# Altium schematic sheet 04_Schematic.SchDoc
size A3; SheetNumber: 4; SheetTotal: 4
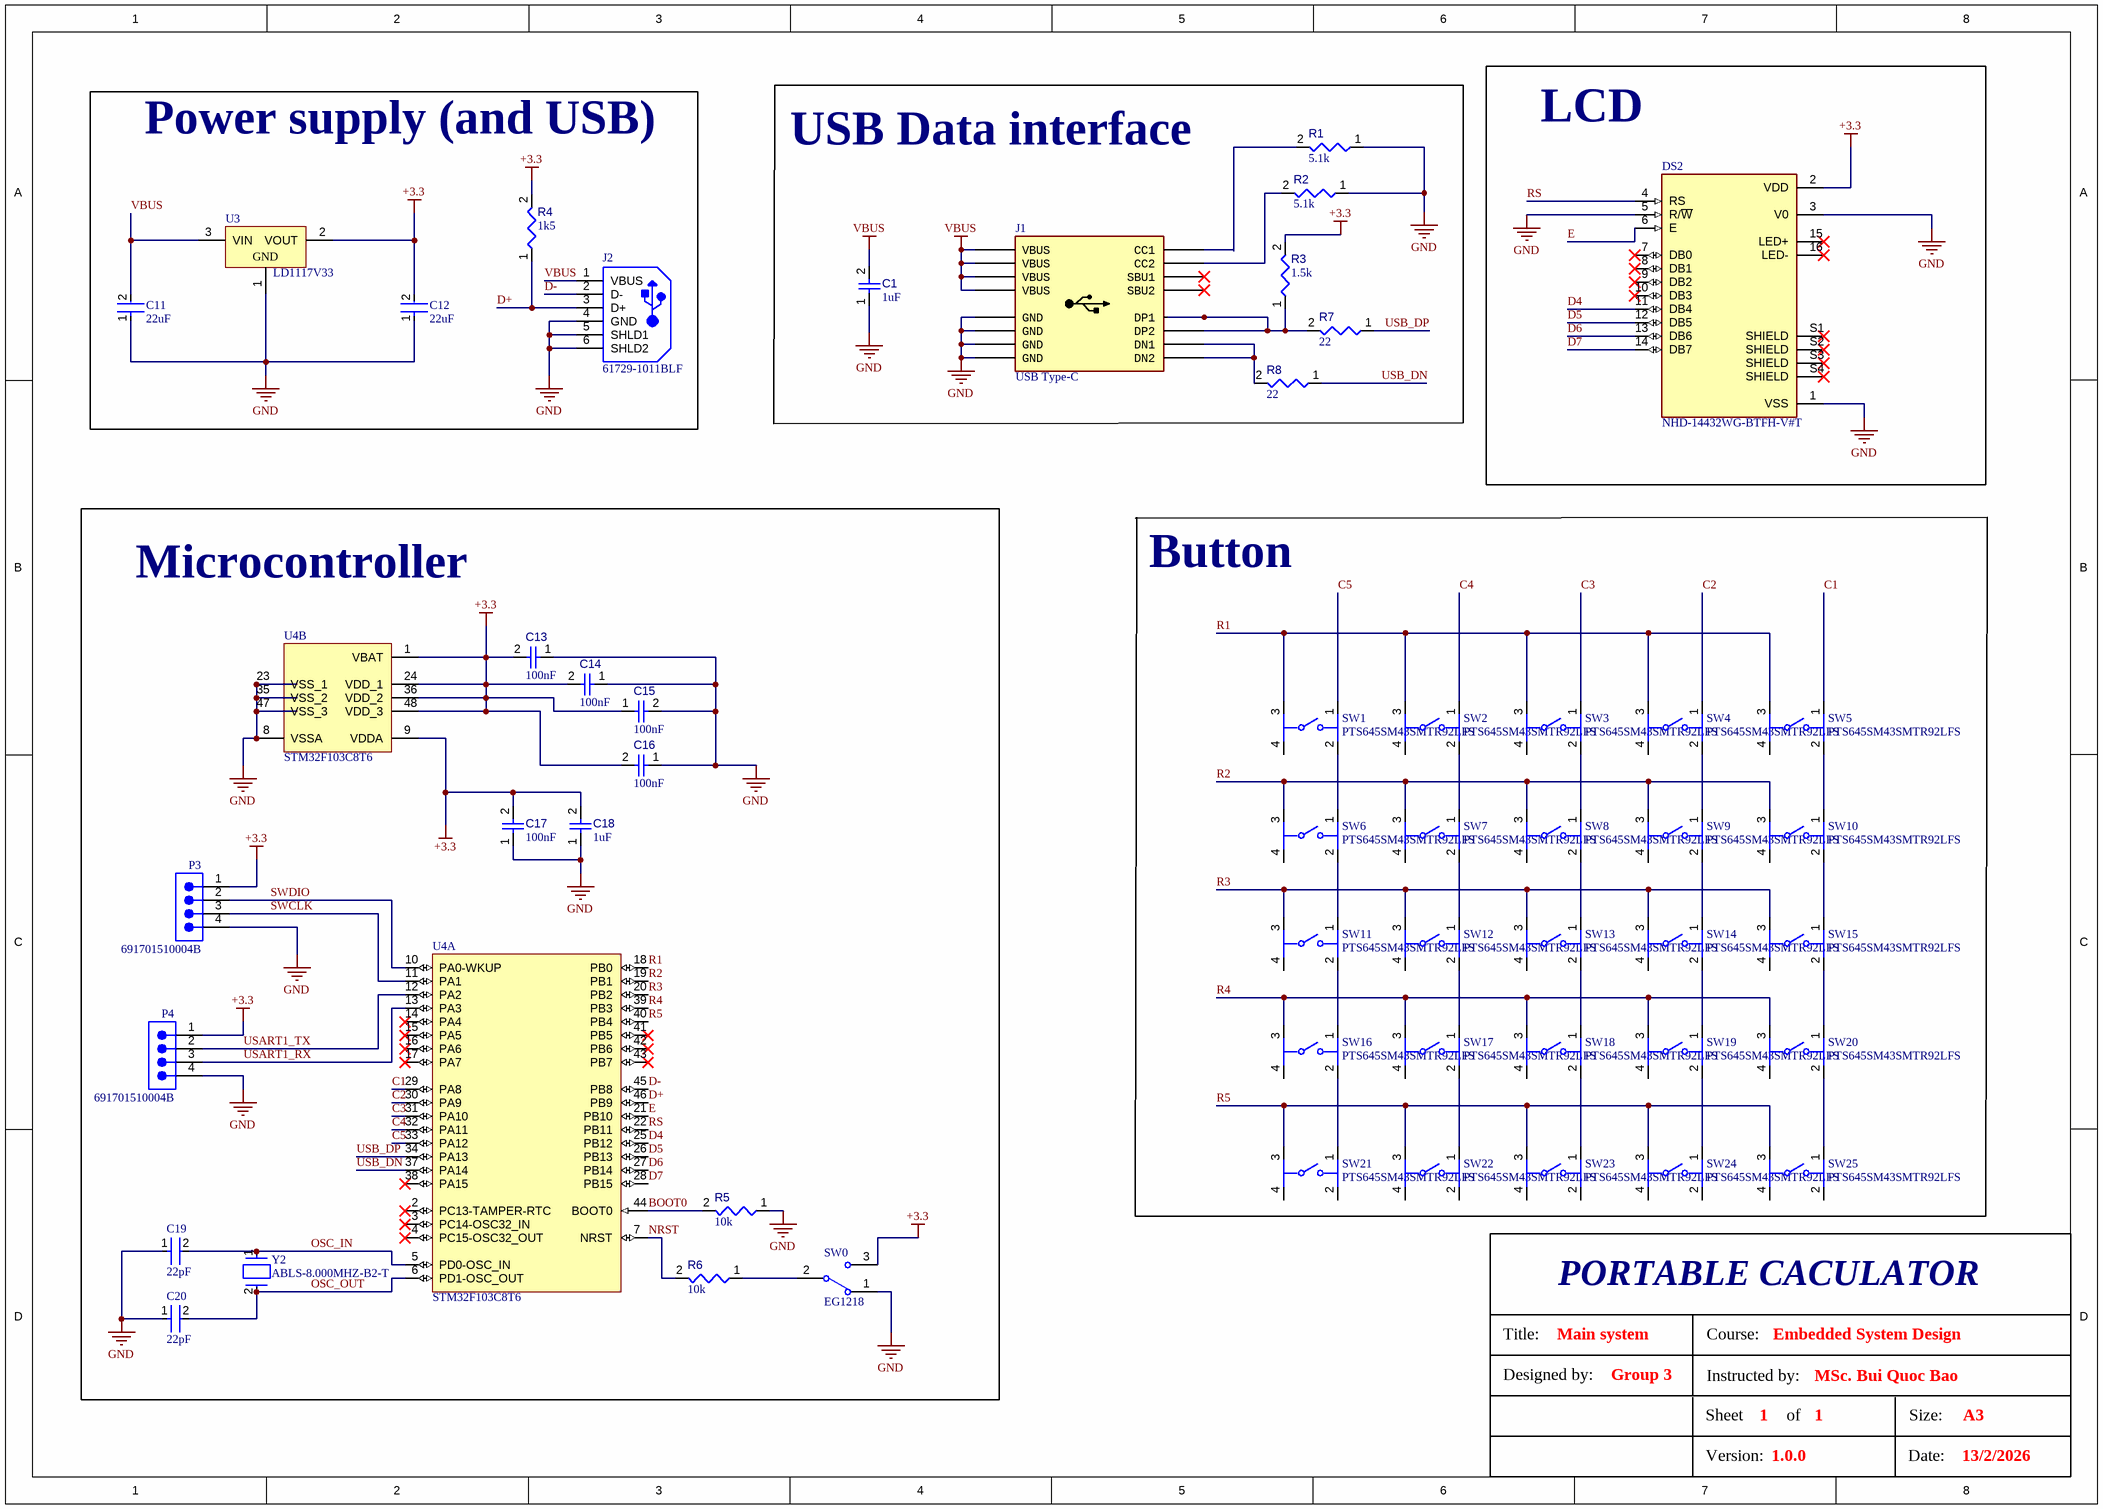
[diagram p0: 04_Schematic.SchDoc]

## Parts
C1  value 1uF  [CAPC1005X56X25LL10T15]  (hidden comment: Capacitor 0.1 uF +/- 5% 16 V 0402)
C11  22uF  [FP-RCE0K1-MFG]
C12  22uF  [FP-RCE0K1-MFG]
C13  value 100nF  [CAPC1005X56X25LL10T15]  (hidden comment: Capacitor 0.1 uF +/- 5% 16 V 0402)
C14  value 100nF  [CAPC1005X56X25LL10T15]  (hidden comment: Capacitor 0.1 uF +/- 5% 16 V 0402)
C15  value 100nF  [CAPC1005X56X25LL10T15]  (hidden comment: Capacitor 0.1 uF +/- 5% 16 V 0402)
C16  value 100nF  [CAPC1005X56X25LL10T15]  (hidden comment: Capacitor 0.1 uF +/- 5% 16 V 0402)
C17  value 100nF  [CAPC1005X56X25LL10T15]  (hidden comment: Capacitor 0.1 uF +/- 5% 16 V 0402)
C18  value 1uF  [CAPC1005X56X25LL10T15]  (hidden comment: Capacitor 0.1 uF +/- 5% 16 V 0402)
C19  22pF  [FP-RCE0K1-MFG]
C20  22pF  [FP-RCE0K1-MFG]
DS2  NHD-14432WG-BTFH-V#T  [LCD_NHD-14432WG-BTFH-V#T]
J1  USB Type-C  [TYPE-C-16POS]
J2  61729-1011BLF  [FCI-61729-1011BLF_V]
P3  691701510004B  [691701510004B]
P4  691701510004B  [691701510004B]
R1  value 5.1k  [RESC0402(1005)_L]  (hidden comment: Resistor 1K +/-5 % 0402 63 mW)
R2  value 5.1k  [RESC0402(1005)_L]  (hidden comment: Resistor 1K +/-5 % 0402 63 mW)
R3  value 1.5k  [RESC0402(1005)_L]  (hidden comment: Resistor 1K +/-5 % 0402 63 mW)
R4  value 1k5  [RESC0402(1005)_L]  (hidden comment: Resistor 1K +/-5 % 0402 63 mW)
R5  value 10k  [RESC0402(1005)_L]  (hidden comment: Resistor 1K +/-5 % 0402 63 mW)
R6  value 10k  [RESC0402(1005)_L]  (hidden comment: Resistor 1K +/-5 % 0402 63 mW)
R7  value 22  [RESC0402(1005)_L]  (hidden comment: Resistor 1K +/-5 % 0402 63 mW)
R8  value 22  [RESC0402(1005)_L]  (hidden comment: Resistor 1K +/-5 % 0402 63 mW)
SW0  EG1218  [ESWI-EG1218_V]
SW1  PTS645SM43SMTR92LFS  [FP-PTS645SM43SMTR92LFS-MFG]
SW2  PTS645SM43SMTR92LFS  [FP-PTS645SM43SMTR92LFS-MFG]
SW3  PTS645SM43SMTR92LFS  [FP-PTS645SM43SMTR92LFS-MFG]
SW4  PTS645SM43SMTR92LFS  [FP-PTS645SM43SMTR92LFS-MFG]
SW5  PTS645SM43SMTR92LFS  [FP-PTS645SM43SMTR92LFS-MFG]
SW6  PTS645SM43SMTR92LFS  [FP-PTS645SM43SMTR92LFS-MFG]
SW7  PTS645SM43SMTR92LFS  [FP-PTS645SM43SMTR92LFS-MFG]
SW8  PTS645SM43SMTR92LFS  [FP-PTS645SM43SMTR92LFS-MFG]
SW9  PTS645SM43SMTR92LFS  [FP-PTS645SM43SMTR92LFS-MFG]
SW10  PTS645SM43SMTR92LFS  [FP-PTS645SM43SMTR92LFS-MFG]
SW11  PTS645SM43SMTR92LFS  [FP-PTS645SM43SMTR92LFS-MFG]
SW12  PTS645SM43SMTR92LFS  [FP-PTS645SM43SMTR92LFS-MFG]
SW13  PTS645SM43SMTR92LFS  [FP-PTS645SM43SMTR92LFS-MFG]
SW14  PTS645SM43SMTR92LFS  [FP-PTS645SM43SMTR92LFS-MFG]
SW15  PTS645SM43SMTR92LFS  [FP-PTS645SM43SMTR92LFS-MFG]
SW16  PTS645SM43SMTR92LFS  [FP-PTS645SM43SMTR92LFS-MFG]
SW17  PTS645SM43SMTR92LFS  [FP-PTS645SM43SMTR92LFS-MFG]
SW18  PTS645SM43SMTR92LFS  [FP-PTS645SM43SMTR92LFS-MFG]
SW19  PTS645SM43SMTR92LFS  [FP-PTS645SM43SMTR92LFS-MFG]
SW20  PTS645SM43SMTR92LFS  [FP-PTS645SM43SMTR92LFS-MFG]
SW21  PTS645SM43SMTR92LFS  [FP-PTS645SM43SMTR92LFS-MFG]
SW22  PTS645SM43SMTR92LFS  [FP-PTS645SM43SMTR92LFS-MFG]
SW23  PTS645SM43SMTR92LFS  [FP-PTS645SM43SMTR92LFS-MFG]
SW24  PTS645SM43SMTR92LFS  [FP-PTS645SM43SMTR92LFS-MFG]
SW25  PTS645SM43SMTR92LFS  [FP-PTS645SM43SMTR92LFS-MFG]
U3  LD1117V33  [STM-TO220-3]
U4  STM32F103C8T6  [STM-LQFP48_M]  (parts A,B of 2)
Y2  ABLS-8.000MHZ-B2-T  [FP-ABLS-MFG]

## Blocks framed on the sheet
LCD: DS2
Power supply (and USB): C11 C12 J2 R4 U3
USB Data interface: C1 J1 R1-R3 R7 R8
Microcontroller: C13-C20 P3 P4 R5 R6 SW0 U4 Y2
Button: SW1-SW25

## Nets
+3.3: C12.2 C13.2 C14.2 C15.1 C16.2 C17.2 C18.2 DS2.2(VDD) P3.1 P4.1 R3.2 R4.2 SW0.3 U3.2(VOUT) U4.1(VBAT) U4.9(VDDA) U4.24(VDD_1) U4.36(VDD_2) U4.48(VDD_3)
GND: C1.1 C11.1 C12.1 C13.1 C14.1 C15.2 C16.1 C17.1 C18.1 C19.1 C20.1 DS2.1(VSS) DS2.3(V0) DS2.5(R/~{W}) J1.A1_B12(GND) J1.A12_B1(GND) J2.4(GND) J2.5(SHLD1) J2.6(SHLD2) P3.4 P4.4 R1.1 R2.1 R5.1 SW0.1 U3.1(GND) U4.8(VSSA) U4.23(VSS_1) U4.35(VSS_2) U4.47(VSS_3)
VBUS: C1.2 C11.2 J1.A4_B9(VBUS) J1.A9_B4(VBUS) J2.1(VBUS) U3.3(VIN)
BOOT0: R5.2 U4.44(BOOT0)
C1: SW5.1 U4.29(PA8)
C2: SW4.1 U4.30(PA9)
C3: SW3.1 U4.31(PA10)
C4: SW2.1 U4.32(PA11)
C5: SW1.1 U4.33(PA12)
D4: DS2.11(DB4) U4.25(PB12)
D5: DS2.12(DB5) U4.26(PB13)
D6: DS2.13(DB6) U4.27(PB14)
D7: DS2.14(DB7) U4.28(PB15)
D+: J2.3(D+) R4.1 U4.46(PB9)
D-: J2.2(D-) U4.45(PB8)
E: DS2.6(E) U4.21(PB10)
NRST: R6.2 U4.7(NRST)
OSC_IN: C19.2 U4.5(PD0-OSC_IN) Y2.1
OSC_OUT: C20.2 U4.6(PD1-OSC_OUT) Y2.2
R1: SW1.3 SW2.3 SW3.3 SW4.3 SW5.3 U4.18(PB0)
R2: SW6.3 SW7.3 SW8.3 SW9.3 SW10.3 U4.19(PB1)
R3: SW11.3 SW12.3 SW13.3 SW14.3 SW15.3 U4.20(PB2)
R4: SW16.3 SW17.3 SW18.3 SW19.3 SW20.3 U4.39(PB3)
R5: SW21.3 SW22.3 SW23.3 SW24.3 SW25.3 U4.40(PB4)
RS: DS2.4(RS) U4.22(PB11)
SWCLK: P3.3 U4.11(PA1)
SWDIO: P3.2 U4.10(PA0-WKUP)
USART1_RX: P4.3 U4.13(PA3)
USART1_TX: P4.2 U4.12(PA2)
USB_DN: R8.1 U4.37(PA14)
USB_DP: R7.1 U4.34(PA13)
NetJ1_A6: J1.A6(DP1) J1.B6(DP2) R3.1 R7.2
NetJ1_A7: J1.A7(DN1) J1.B7(DN2) R8.2
NetJ1_B5: J1.B5(CC2) R2.2
NetR6_1: R6.1 SW0.2(COM)
NetSW1_2: SW1.2 SW6.1
NetSW2_2: SW2.2 SW7.1
NetSW3_2: SW3.2 SW8.1
NetSW4_2: SW4.2 SW9.1
NetSW5_2: SW5.2 SW10.1
NetSW6_2: SW6.2 SW11.1
NetSW7_2: SW7.2 SW12.1
NetSW8_2: SW8.2 SW13.1
NetSW9_2: SW9.2 SW14.1
NetSW10_2: SW10.2 SW15.1
NetSW11_2: SW11.2 SW16.1
NetSW12_2: SW12.2 SW17.1
NetSW13_2: SW13.2 SW18.1
NetSW14_2: SW14.2 SW19.1
NetSW15_2: SW15.2 SW20.1
NetSW16_2: SW16.2 SW21.1
NetSW17_2: SW17.2 SW22.1
NetSW18_2: SW18.2 SW23.1
NetSW19_2: SW19.2 SW24.1
NetSW20_2: SW20.2 SW25.1

Not connected (* = marked no-connect by the designer): DS2 7(DB0)* 8(DB1)* 9(DB2)* 10(DB3)* 15(LED+)* 16(LED-)* S1(SHIELD)* S2(SHIELD)* S3(SHIELD)* S4(SHIELD)*; J1 A5(CC1) A8(SBU1)* B8(SBU2)*; R1 2; SW1 4; SW2 4; SW3 4; SW4 4; SW5 4; SW6 4; SW7 4; SW8 4; SW9 4; SW10 4; SW11 4; SW12 4; SW13 4; SW14 4; SW15 4; SW16 4; SW17 4; SW18 4; SW19 4; SW20 4; SW21 2 4; SW22 2 4; SW23 2 4; SW24 2 4; SW25 2 4; U4 2(PC13-TAMPER-RTC)* 3(PC14-OSC32_IN)* 4(PC15-OSC32_OUT)* 14(PA4)* 15(PA5)* 16(PA6)* 17(PA7)* 38(PA15)* 41(PB5)* 42(PB6)* 43(PB7)*

## Notes on the sheet
- PORTABLE CACULATOR
- Designed by:
- Title:
- Main system
- Group 3
- Instructed by:
- Course:
- Embedded System Design
- MSc. Bui Quoc Bao
- Version:
- Sheet
- 1
- 1.0.0
- of
- Date:
- Size:
- 13/2/2026
- A3
- DWG NO:
- REV:
- THIS DOCUMENT AND THE DATA DISCLOSED HEREIN OR
- HEREWITH IS THE PROPERTY OF ALTIUM LIMITED AND MAY
- BE FREELY DISTRIBUTED IN WHOLE. NO RIGHTS ARE
- RESERVED OR EXPRESS OR IMPLIED WARANTEE GIVEN.
- REVISION
- DESCRIPTION
- DATE
- APPROVED
- ENG:
- APPROVALS
- PROJECT
- DSN:
- CHK:
- REFERENCE DOCUMENTS
- PROJECT REVISION:
- TITLE
- DOCUMENT REVISION:
- DESIGN ITEM:
- BOM:
- FAB DWG:
- PCB DWG:
- ASSY DWG:
- SCALE:
- A2
- SIZE
- CAGE CODE
- FILE NAME
- DWG NO.
- SHEET
- OF
- REV

## Library data of the parts
C1 C13-C18 = CMP-001-00001-6: Chip Capacitor, 0.1 uF, +/- 5%, 16 V, 0402 (1005 Metric); Capacitor Type: Ceramic; Voltage Rating: 16V; Max Operating Temperature: 125°C; Min Operating Temperature: -55°C; Case/Package: 0402; Mounting Technology: SM; Pins: 2; Tolerance: 5%; RoHS Compliant: True
C11 C12 C19 C20 = CMP-06035-047580-1: Cap Ceramic 22pF 50V C0G ±5% Radial 5mm +125°C Automotive Bulk; Lead/Base Style: Formed Leads; Lead Diameter: 0.5mm; Tolerance: 5%; Dielectric: C0G; Case/Package: Radial; Min Operating Temperature: -55°C; Height: 3.5mm; Length: 0.142inch; Height - Seated (Max): 0.138inch; Lead Pitch: 0.197inch; Resistor Type: Ceramic; Max Operating Temperature: 125°C; Package Quantity: 500; Capacitance: 22pF; Mount: Through Hole; Ratings: AEC-Q200; Termination: Radial; Voltage Rating: 50V; Width: 0.098inch; Voltage Rating (DC): 50V; Packaging: Bulk
DS2 = CMP-007-00039-1: - Graphic LCD Display Module Transflective Black (White - Inverted) FSTN - Film Super-Twisted Nematic Parallel, 8-Bit - 144 x 32; MF: Newhaven Display; Pins: 20; Value: *; Source: NHD-14432WG-BTFH-V#T.SchLib; SnapEDA_Link: https://www.snapeda.com/parts/NHD-14432WG-BTFH-V%23T/Newhaven+Display+Intl/view-part/?ref=snap; Purchase-URL: https://pricing.snapeda.com/search/part/NHD-14432WG-BTFH-V#T/?ref=eda; Case/Package: None; Check_prices: https://www.snapeda.com/parts/NHD-14432WG-BTFH-V%23T/Newhaven+Display+Intl/view-part/?ref=eda; Price: None; Design Item ID: NHD-14432WG-BTFH-V#T; MP: NHD-14432WG-BTFH-V#T; Availability: In Stock; Component Type: Standard
J2 = CMP-002-00041-2: USB Receptacle B Type, Right Angle, 4 Position, Height 11.5 mm,-40 to 85 degC, RoHS, Tube; Manufacturer: FCI Electronics; Current Rating: 1.5A; Gender: Female; Contact Material: Copper; Contact Plating: Nickel; Colour: Black; Max Operating Temperature: 40°C; Datasheet URL: http://portal.fciconnect.com/Comergent/fci/drawing/61729.pdf; Pins: 4; Lead Pitch: 2.5mm; Mounting Technology: TH; Packaging: Rail/Tube; Package Description: 4-Pin Through Hole Device, Body 16 x 12.2 mm; RoHS Compliant: True; Case/Package: 61729-1011BLF; Package Quantity: 44; Manufacturer URL: http://portal.fciconnect.com/; Package Reference: 61729-1011BLF; Datasheet Version: Rev. W, 05/2014; Connector Type: USB; Min Operating Temperature: 0°C
P3 P4 = CMP-1502-02331-3: Terminal Block, 5.08MM, Close Vertical Pcb Header, Thr Type, 4 Pins; Number of Contacts: 4; Voltage Rating: 300V; Current Rating: 10A; Gender: Male; Contact Material: Brass; Number of Pins: 4; REACH SVHC: Unknown; Lead Pitch: 5.08mm; Connector Type: Terminal Block; Max Operating Temperature: 105°C; Min Operating Temperature: -40°C; Housing Material: Polymer; Contact Plating: Tin; Mount: Through Hole; RoHS: Compliant; Color: Black; Pitch: 5.08mm; Length: 23.12mm; Termination: PCB
R1-R8 = CMP-009-00157-3: Chip Resistor, 1 kOhms, +/-5 %, 63 mW, -55 to 155 degC, 0402; Tolerance: 5%; Power: 63mW; Case/Package: 0402; Pins: 2; Min Operating Temperature: -55°C; Max Operating Temperature: 155°C
SW0 = CMP-011-00006-2: Slide Switch, SPDT, 500 V, -20 to 70 degC, 3-Pin THD, RoHS, Bulk; Manufacturer: E-Switch; Voltage Rating (DC): 30V; Current Rating: 200mA; Operating Force: 250gf; Package Quantity: 1000; Contact Plating: Silver; Max Operating Temperature: 70°C; Min Operating Temperature: -20°C; Contact Material: Copper; Datasheet URL: https://www.e-switch.com/system/asset/product_line/data_sheet/119/EG.pdf; Contact Finish: Silver; Case/Package: EG1218; Voltage Rating (AC): 30V; Datasheet Version: Oct-15; Package Description: 3-Pin Through Hole Device, Body 11.6 x 4 mm, Pitch 2.5 mm; RoHS Compliant: True; Package Reference: EG1218; Manufacturer URL: http://www.e-switch.ch/en/; Throw Configuration: SPDT; Contact Current Rating: 200mA; Mounting Technology: TH; Packaging: Bulk; Pins: 3
SW1-SW25 = CMP-2000-05160-2: SWITCH TACTILE SPST-NO 0.05A 12V; Contact Resistance: 100mR; Throw Configuration: SPST; Illumination Type: Non-Illuminated; Mechanical Life: 100000Cycles; Current Rating: 50mA; Switch Function: Off-Mom; Actuator Length: 0.85mm; Actuator Material: Nylon; Actuator Type: Standard; Operating Force: 160gf; Min Operating Temperature: -20°C; REACH SVHC: No SVHC; Termination: Gull Wing; Case/Package: SMD/SMT; Packaging: Tape and Reel; Mount: Surface Mount; Voltage Rating (DC): 12V; Orientation: Straight; Lead Free: Lead Free; Contact Material: Silver; Color: Black; Max Current Rating: 50mA; Contact Plating: Silver; Depth: 9mm; Package Quantity: 1; Max Voltage Rating (DC): 12V; Length: 6mm; Max Operating Temperature: 60°C
U3 = CMP-019-00020-3: Low Drop Positive Voltage Regulator, 800 mA, Fixed 3.3 V Output, 0 to 125 degC, 3-Pin TO-220, RoHS, Tube; Manufacturer: STMicroelectronics; Max Supply Voltage: 15V; Max Ouput Current: 800mA; Output Voltage: 3.3V; Power: 12W; Min Supply Voltage: 4.75V; Output Current: 1.3A; Outputs: 1; Min Input Voltage: 4.4V; Dropout Voltage: 1.1V; Datasheet Version: Rev. A, 07/2003; Case/Package: TO-220-3; Package Quantity: 50; Max Input Voltage: 15V; Manufacturer URL: http://www.st.com/; Min Operating Temperature: 0°C; Datasheet URL: http://www.farnell.com/datasheets/1776449.pdf; Max Operating Temperature: 125°C; Nominal Output Voltage: 3.3V; RoHS Compliant: True; Pins: 3; Packaging: Rail/Tube
U4 = CMP-00001-1: MCU 32-bit STM32F1 ARM Cortex M3 RISC 64KB Flash 2.5V/3.3V 48-Pin LQFP Tray; Manufacturer Package Identifier: ai14911d; Number of I/Os: 37; Number of PWM Channels: 1; Nominal Supply Current: 1.7µA; Number of USART Channels: 3; Data Bus Width: 32b; Number of Programmable I/O: 48; Peripherals: POR; Clock Frequency: 16MHz; Number of Interrupts: 16; Number of I2C Channels: 2; ADC Channels (Resolution): 10-Ch 12-Bit; Max Power Dissipation: 363mW; Frequency: 72MHz; Number of Bits: 32; RAM Size: 20kB; EEPROM Memory Size: 0B; Max Supply Current: 50mA; Density: 512kb; Operating Supply Voltage: 3.3V; Interface: CAN, USB; Number of ADC Channels: 10; Number of Timers/Counters: 4; Oscillator Type: Internal; Watchdog Timer: Yes; Min Supply Voltage: 2V; Max Supply Voltage: 3.6V; RoHS: Compliant; Memory Size: 64kB; Harmonized Tariff Schedule (HTS) Code: 8542.31.00.25; Country of Origin: Malaysia; Length: 7mm; REACH SVHC: Yes; Introduction Date: 2007-06-07; Core Architecture: ARM; Radiation Hardening: No; Termination: SMD/SMT; Address Bus Width: 32b; Pins: 48; Lead Free: Lead Free; Schedule B: 8542310000; Width: 7mm; Number of SPI Channels: 2; Flash Memory Size: 64kB; Memory Format: FLASH; Height - Seated (Max): 1.6mm; Temperature Grade: Industrial; Case/Package: LQFP; Number of A/D Converters: 2; Height: 1.45mm; Export Control Classification Number (ECCN) Code: 3A991.A.2; Number of Terminals: 48; Lifecycle Status: Production; Number of Channels: 10; Min Operating Temperature: -40°C; Mounting Technology: Surface Mount; Terminal Pitch: 500µm; Max Operating Temperature: 85°C; China RoHS: Compliant
Y2 = CMP-27762-009874-1: CRYSTAL 8.0000MHZ 18PF SMD; ESR (Equivalent Series Resistance): 80R; Operating Frequency: 8 MHz; Frequency Stability: 50ppm; Tolerance: 20ppm; Frequency: 8MHz; Min Operating Temperature: -20°C; Lead Free: Lead Free; Width: 4.7mm; Packaging: Tape and Reel; Series: ABLS; Accuracy: 20ppm; Length: 11.4mm; Frequency Tolerance: 20ppm; Termination: SMD/SMT; Number of Pins: 2; Radiation Hardening: No; Depth: 4.7mm; REACH SVHC: No SVHC; Contact Plating: Tin; Load Capacitance: 18pF; Case/Package: SMD/SMT; Mount: Surface Mount; Package Quantity: 1000; Max Operating Temperature: 70°C; Height: 0.165inch; Series Resistance: 80R